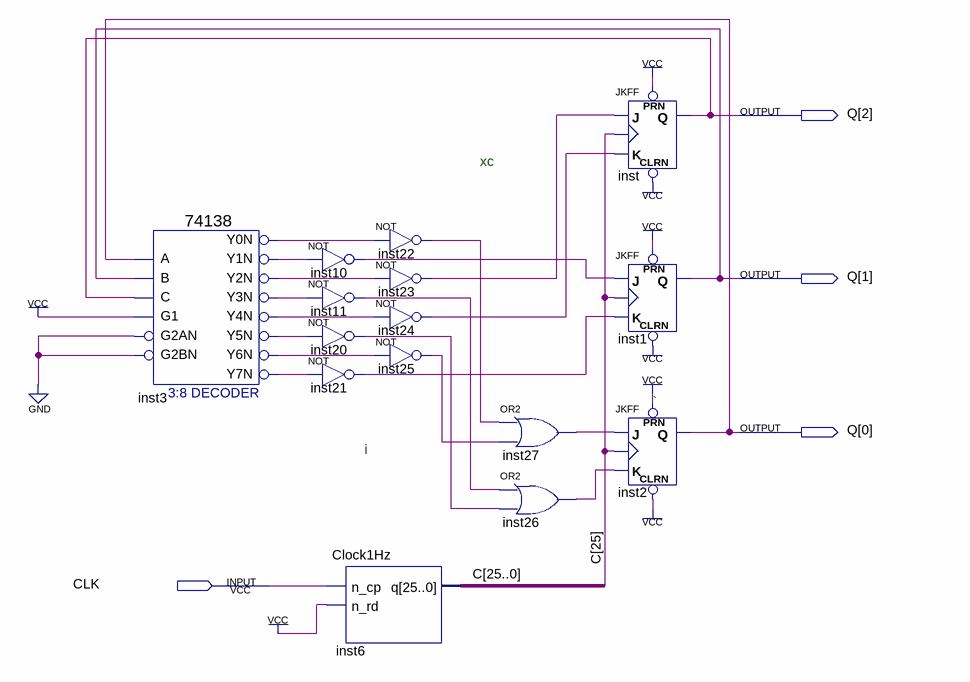
[diagram p0: schematic sheet]
// Quartus schematic GrayCode.bdf as structural Verilog: 15 symbols, 4 pins
module GrayCode (
  input  CLK,
  output [2:0] Q
);

  wire inst3_y0n, inst3_y1n, inst3_y2n, inst3_y3n, inst3_y4n, inst3_y5n, inst3_y6n, inst3_y7n, inst10_out,
       inst11_out, inst20_out, inst21_out, inst22_out, inst23_out, inst24_out, inst25_out, inst26_out,
       inst27_out;
  wire [25:0] C;

  \74138  inst3 (
    .A(Q[0]), .B(Q[1]), .G1(1'b1), .C(Q[2]), .G2AN(1'b0), .G2BN(1'b0), .Y0N(inst3_y0n), .Y1N(inst3_y1n),
    .Y2N(inst3_y2n), .Y3N(inst3_y3n), .Y4N(inst3_y4n), .Y5N(inst3_y5n), .Y6N(inst3_y6n), .Y7N(inst3_y7n));
  not inst10 (inst10_out, inst3_y1n);
  not inst11 (inst11_out, inst3_y3n);
  not inst20 (inst20_out, inst3_y5n);
  not inst21 (inst21_out, inst3_y7n);
  not inst22 (inst22_out, inst3_y0n);
  not inst23 (inst23_out, inst3_y2n);
  not inst24 (inst24_out, inst3_y4n);
  not inst25 (inst25_out, inst3_y6n);
  Clock1Hz inst6 (.n_cp(CLK), .n_rd(1'b1), .q(C));
  or inst27 (inst27_out, inst22_out, inst25_out);
  or inst26 (inst26_out, inst11_out, inst20_out);
  JKFF inst (.PRN(1'b1), .CLRN(1'b1), .K(inst24_out), .J(inst23_out), .CLK(C[25]), .Q(Q[2]));
  JKFF inst1 (.PRN(1'b1), .CLRN(1'b1), .K(inst21_out), .J(inst10_out), .CLK(C[25]), .Q(Q[1]));
  JKFF inst2 (.PRN(1'b1), .CLRN(1'b1), .K(inst26_out), .J(inst27_out), .CLK(C[25]), .Q(Q[0]));

  // Notes on the sheet:
  //   xc
  //   `
  //   i
endmodule
